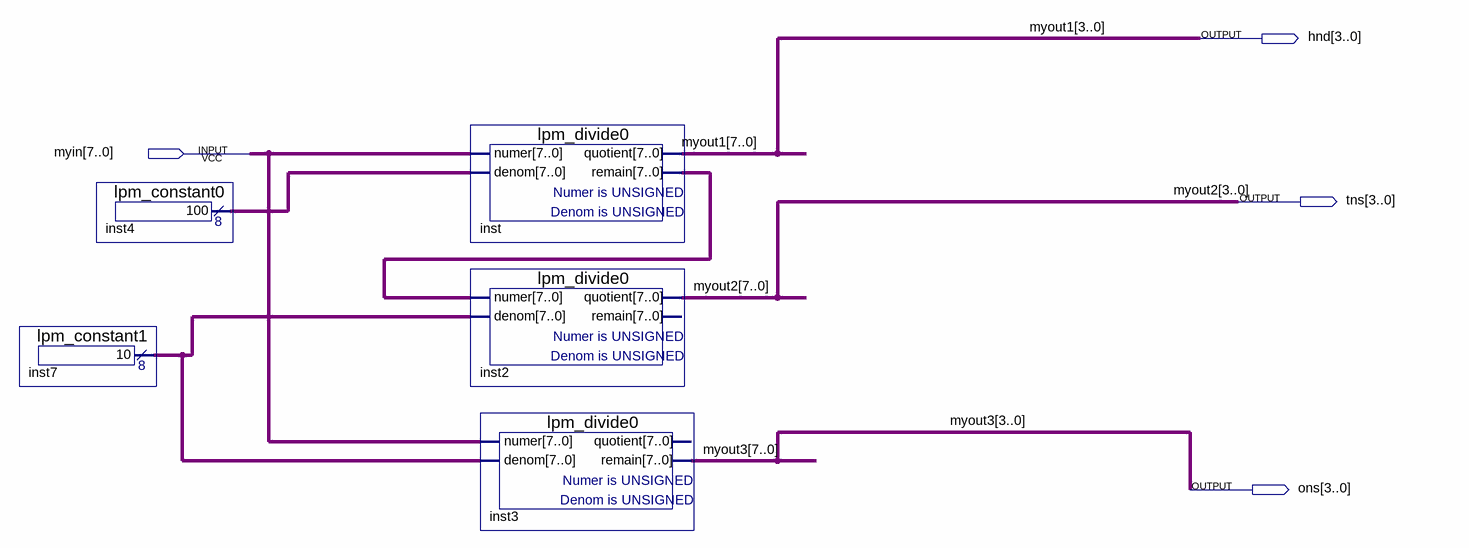
[diagram p0: schematic sheet]
// Quartus schematic binbcddes.bdf as structural Verilog: 5 symbols, 4 pins
module binbcddes (
  input  [7:0] myin,
  output [3:0] hnd,
  output [3:0] tns,
  output [3:0] ons
);

  wire [7:0] inst4_result, inst7_result, inst_remain;
  wire [7:4] myout1, myout2, myout3;

  lpm_constant1 inst7 (.result(inst7_result));
  lpm_constant0 inst4 (.result(inst4_result));
  lpm_divide0 inst (.numer(myin), .denom(inst4_result), .quotient({myout1, hnd}), .remain(inst_remain));
  lpm_divide0 inst2 (.numer(inst_remain), .denom(inst7_result), .quotient({myout2, tns}));  // open: remain
  lpm_divide0 inst3 (.numer(myin), .denom(inst7_result), .remain({myout3, ons}));  // open: quotient

  // Other names for the same wires on the sheet: myout1[3:0] = hnd; myout2[3:0] = tns; myout3[3:0] = ons
endmodule
